# Altium project balancing.PrjPcb
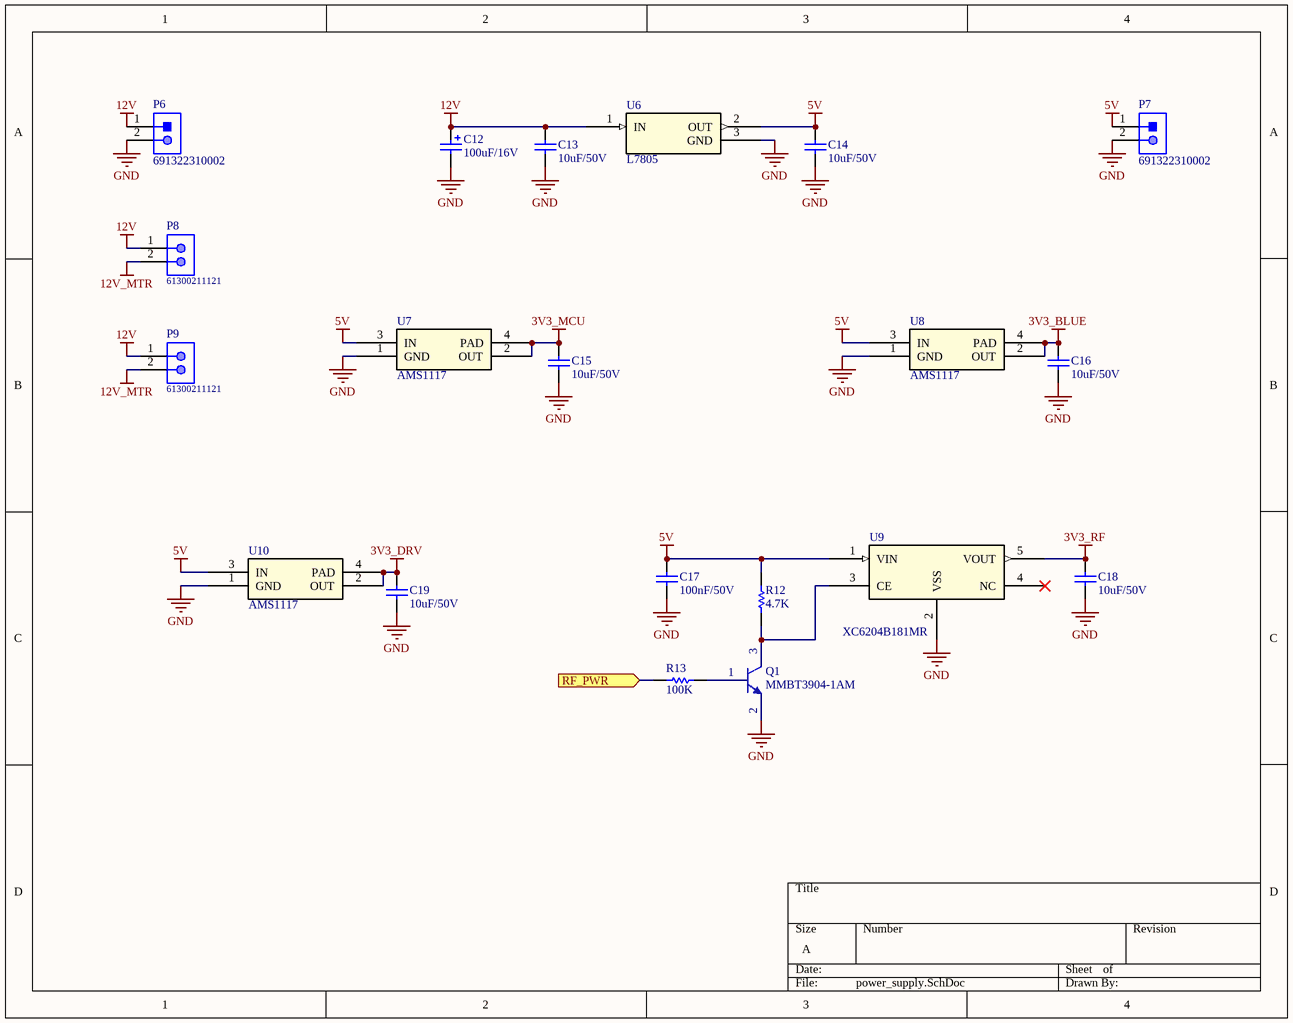
[diagram p0: power_supply.SchDoc]
4 sheets, 74 parts. Net scope: flat (ports and power ports of the same name join across sheets).
Board file: balancing.PcbDoc
Sheets:
  power_supply.SchDoc
  motor_controller.SchDoc
  mcu.SchDoc
  communication.SchDoc

## Sheet power_supply.SchDoc
size A

### Parts
C12  value 100uF/16V  [CAP-SM-AL-SIZE-D-D6L6]  (hidden comment: Cap-Al-100uF-16V-D6L5)
C13  value 10uF/50V  [CAP-SM-0805]  (hidden comment: Cap-10uF-50V-0805)
C14  value 10uF/50V  [CAP-SM-0805]  (hidden comment: Cap-10uF-50V-0805)
C15  value 10uF/50V  [CAP-SM-0805]  (hidden comment: Cap-10uF-50V-0805)
C16  value 10uF/50V  [CAP-SM-0805]  (hidden comment: Cap-10uF-50V-0805)
C17  value 100nF/50V  [CAP-SM-0805]  (hidden comment: Cap-100nF-50V-0805)
C18  value 10uF/50V  [CAP-SM-0805]  (hidden comment: Cap-10uF-50V-0805)
C19  value 10uF/50V  [CAP-SM-0805]  (hidden comment: Cap-10uF-50V-0805)
P6  691322310002  [691322310002]
P7  691322310002  [691322310002]
P8  61300211121  [61300211121]
P9  61300211121  [61300211121]
Q1  MMBT3904-1AM  [SOT23_NEX]
R12  value 4.7K  [RES-SM-0805]  (hidden comment: Res-4.7K-0805)
R13  value 100K  [RES-SM-0805]  (hidden comment: Res-100K-0805)
U6  L7805  [L7805]
U7  AMS1117  [AMS1117]
U8  AMS1117  [AMS1117]
U9  XC6204B181MR  [XC6204B181MR]
U10  AMS1117  [AMS1117]

### Ports
RF_PWR (in)

### Nets
3V3_BLUE: C16.2 U8.2(OUT) U8.4(PAD)
3V3_DRV: C19.2 U10.2(OUT) U10.4(PAD)
3V3_MCU: C15.2 U7.2(OUT) U7.4(PAD)
3V3_RF: C18.2 U9.5(VOUT)
5V: C14.2 C17.2 P7.1 R12.2 U6.2(OUT) U7.3(IN) U8.3(IN) U9.1(VIN) U10.3(IN)
12V: C12.1 C13.2 P6.1 P8.1 P9.1 U6.1(IN)
12V_MTR: P8.2 P9.2
GND: C12.2 C13.1 C14.1 C15.1 C16.1 C17.1 C18.1 C19.1 P6.2 P7.2 Q1.2(E) U6.3(GND) U7.1(GND) U8.1(GND) U9.2(VSS) U10.1(GND)
NetMCU1_15: R13.1 ; port RF_PWR
NetQ1_1: Q1.1(B) R13.2
NetQ1_3: Q1.3(C) R12.1 U9.3(CE)

Not connected (* = marked no-connect by the designer): U9 4(NC)*

### Library data of the parts
C12 = Cap-Al-100uF-16V-D6L5: CAP ALUM 100UF 20% 16V SMD; Manufacturer: Nichicon; Manufacturer Part Number: UWX1C101MCL1GB; Local Supplier: thegioiic; Local Supplier Link: https://thegioiic.com/products/tu-nhom-smd-100uf-16v-d6-3l5-4; Supplier 1: Digikey; Supplier 1 Part Number: 493-2105-1-ND; Supplier 1 Link: https://www.digikey.com/product-detail/en/nichicon/UWX1C101MCL1GB/493-2105-1-ND/590080
C13-C16 C18 C19 = Cap-10uF-50V-0805: CAP CER 10UF 50V X5R 0805; Manufacturer: Yageo; Manufacturer Part Number: CC0805KKX5R9BB106; Local Supplier: thegioiic; Local Supplier Link: https://thegioiic.com/products/tu-10uf-50v-0805; Supplier 1: Digikey; Supplier 1 Link: https://www.digikey.com/product-detail/en/yageo/CC0805KKX5R9BB106/311-3499-2-ND/7164383; Supplier 1 Part Number: 311-3499-2-ND
C17 = Cap-100nF-50V-0805: CAP CER 0.1UF 50V Y5V 0805; Manufacturer: Samsung Electro-Mechanics; Manufacturer Part Number: CL21F104ZBCNNNC; Local Supplier: thegioiic; Local Supplier Link: https://thegioiic.com/products/tu-100nf-0-1uf-50v-0805; Supplier 1: Digikey; Supplier 1 Part Number: 1276-1007-1-ND; Supplier 1 Link: https://www.digikey.com/product-detail/en/samsung-electro-mechanics/CL21F104ZBCNNNC/1276-1007-1-ND/3889093
P6 P7 = 691322310002: WR-TBL Serie 322 Horizontal PCB Header, Pluggable, pitch 3.81mm, 2p; Compliance: RoHS; Modularity: No; Pin Number: 2; Rated Current [UL]: 10A; Working Voltage [UL]: 300VAC; ComponentLink1Description: Manufacturer; ComponentLink1URL: http://www.we-online.de; ComponentLink2URL: https://katalog.we-online.de/em/datasheet/691322310002.pdf; ComponentLink2Description: Datasheet; Mounting Technology: THT; Part Number: 691322310002; Packaging: Box; Operating Temperature: -40 to +105degC; PCB/Cable/Panel: PCB; Pitch: 3.81mm; Published Date: October 2019; Type: Horizontal; Publisher: Wurth Elektronik; Application: Pluggable
P8 P9 = 61300211121: WR-PHD Pin Header, THT, pitch 2.54mm, Single Row, Vertical, 2p; Manufacturer: Wurth Elektronik; Pin Number: 2; Rated Current: 3A; Working Voltage: 250VAC; Withstanding Voltage: 500VAC; Contact Resistance: 20mOhm; ComponentLink1Description: Manufacturer; ComponentLink1URL: http://www.we-online.de; ComponentLink2Description: Datasheet; ComponentLink2URL: https://www.we-online.com/catalog/datasheet/61300211121.pdf; Manufacturer Part Number: 61300211121; Published Date: May 2020; Pitch: 2.54mm; Operating Temperature: -40 to +105degC; Mounting Technology: THT; Packaging: Bag; Gender: Pin Header; Row Number: Single; Orientation: Vertical
R12 = Res-4.7K-0805: RES SMD 4.7K OHM 5% 1/8W 0805; Manufacturer: Yageo; Manufacturer Part Number: RC0805JR-074K7L; Local Supplier: thegioiic; Local Supplier Link: https://thegioiic.com/products/dien-tro-4-7k-ohm-0805-5; Supplier 1: Digikey; Supplier 1 Link: https://www.digikey.com/product-detail/en/yageo/RC0805JR-074K7L/311-4.7KARCT-ND/731274; Supplier 1 Part Number: 311-4.7KARCT-ND
R13 = Res-100K-0805: RES 0 OHM JUMPER 0805; Manufacturer: Vishay Dale; Manufacturer Part Number: WSL080500000ZEA9; Local Supplier: thegioiic; Local Supplier Link: https://thegioiic.com/products/dien-tro-0-ohm-0805-5; Supplier 1: Digikey; Supplier 1 Link: https://www.digikey.com/product-detail/en/vishay-dale/WSL080500000ZEA9/541-3928-1-ND/7423223; Supplier 1 Part Number: 541-3928-1-ND
U6 = L7805: Manufacturer_Part_Number: L7805CDT-TR; Vendor: STMicroelectronics; Built_By: EMA_UL_Team; Copyright: Copyright (C) 2018 Accelerated Designs. All rights reserved; RefDes: RefDes; Type: DEV
U7 U8 U10 = AMS1117: Built_By: EMA_Matt; Vendor: AMS; SourceLibrary: AMS_2019-10-31; Manufacturer_Part_Number: AMS1117; Copyright: Copyright (C) 2018 Accelerated Designs. All rights reserved; RefDes: RefDes; Type: DEV
U9 = XC6204B181MR: Vendor: Torex Semiconductor; Built_By: EMA_UL_Team; SourceLibrary: Torex_2016-07-05_1; Manufacturer_Part_Number: XC6204B181MR; Copyright: Copyright (C) 2018 Accelerated Designs. All rights reserved; RefDes: RefDes; Type: DEV

## Sheet motor_controller.SchDoc
size A
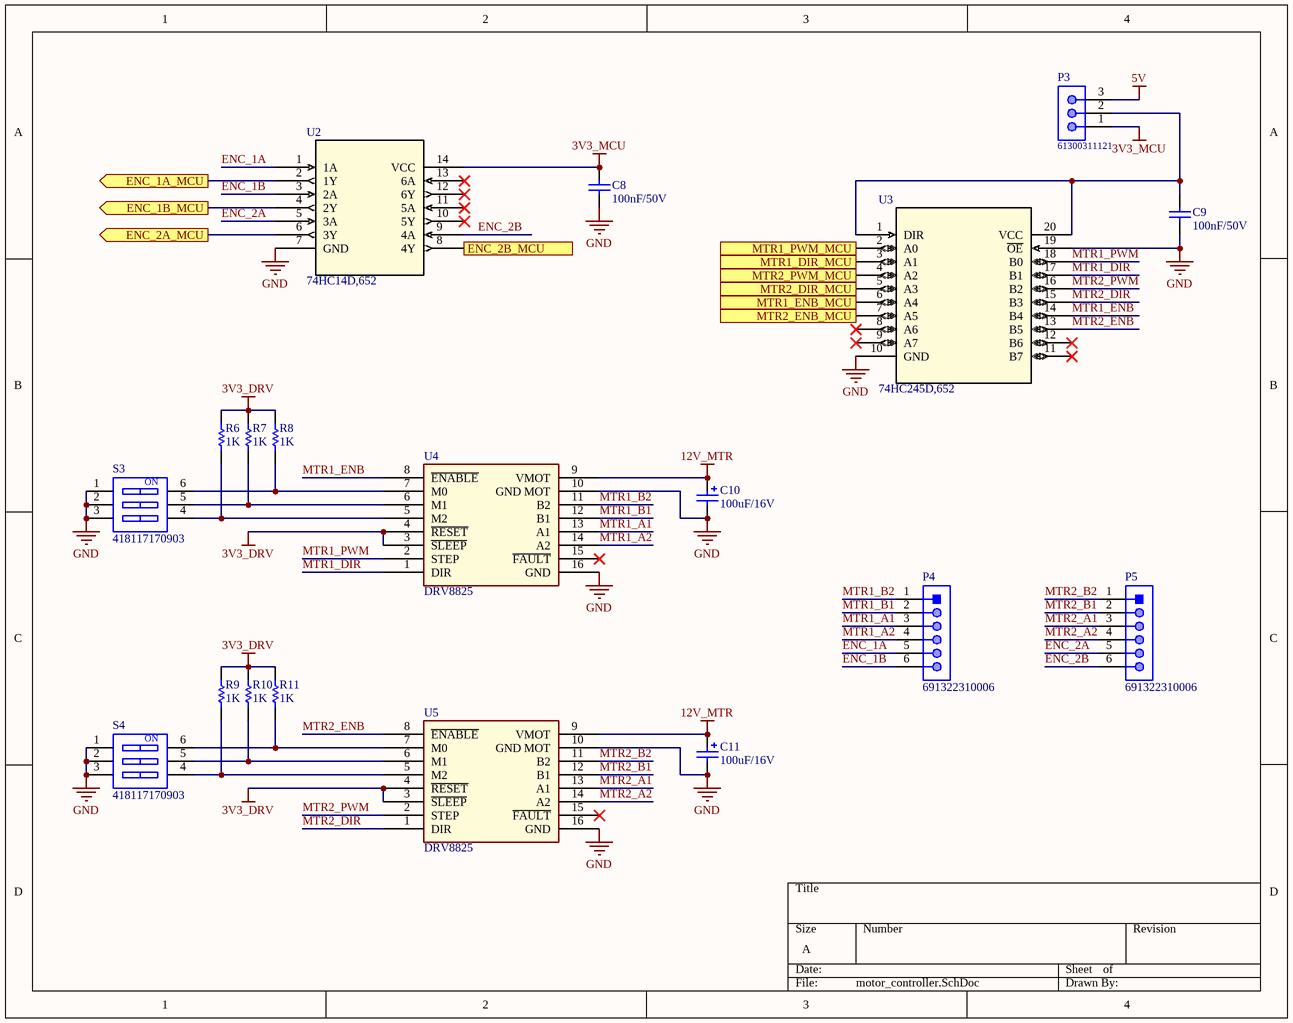
[diagram p1: motor_controller.SchDoc]

### Parts
C8  value 100nF/50V  [CAP-SM-0805]  (hidden comment: Cap-100nF-50V-0805)
C9  value 100nF/50V  [CAP-SM-0805]  (hidden comment: Cap-100nF-50V-0805)
C10  value 100uF/16V  [CAP-SM-AL-SIZE-D-D6L6]  (hidden comment: Cap-Al-100uF-16V-D6L5)
C11  value 100uF/16V  [CAP-SM-AL-SIZE-D-D6L6]  (hidden comment: Cap-Al-100uF-16V-D6L5)
P3  61300311121  [61300311121]
P4  691322310006  [691322310006]
P5  691322310006  [691322310006]
R6  value 1K  [RES-SM-0805]  (hidden comment: Res-1K-0805)
R7  value 1K  [RES-SM-0805]  (hidden comment: Res-1K-0805)
R8  value 1K  [RES-SM-0805]  (hidden comment: Res-1K-0805)
R9  value 1K  [RES-SM-0805]  (hidden comment: Res-1K-0805)
R10  value 1K  [RES-SM-0805]  (hidden comment: Res-1K-0805)
R11  value 1K  [RES-SM-0805]  (hidden comment: Res-1K-0805)
S3  418117170903  [418117170903]
S4  418117170903  [418117170903]
U2  74HC14D,652  [74HC14D,652]
U3  74HC245D,652  [74HC245D,652]
U4  DRV8825  [DRV8825]
U5  DRV8825  [DRV8825]

### Ports
ENC_1A_MCU (out), ENC_1B_MCU (out), ENC_2A_MCU (out), ENC_2B_MCU (out), MTR1_DIR_MCU (in), MTR1_ENB_MCU (in), MTR1_PWM_MCU (in), MTR2_DIR_MCU (in), MTR2_ENB_MCU (in), MTR2_PWM_MCU (in)

### Nets
3V3_DRV: R6.2 R7.2 R8.2 R9.2 R10.2 R11.2 U4.3(~{SLEEP}) U4.4(~{RESET}) U5.3(~{SLEEP}) U5.4(~{RESET})
3V3_MCU: C8.2 P3.1 U2.14(VCC)
5V: P3.3
12V_MTR: C10.1 C11.1 U4.9(VMOT) U5.9(VMOT)
GND: C8.1 C9.1 C10.2 C11.2 S3.1 S3.2 S3.3 S4.1 S4.2 S4.3 U2.7(GND) U3.10(GND) U3.19(~{OE}) U4.10(GND_MOT) U4.16(GND) U5.10(GND_MOT) U5.16(GND)
ENC_1A: P4.5 U2.1(1A)
ENC_1B: P4.6 U2.3(2A)
ENC_2A: P5.5 U2.5(3A)
ENC_2B: P5.6 U2.9(4A)
MTR1_A1: P4.3 U4.13(A1)
MTR1_A2: P4.4 U4.14(A2)
MTR1_B1: P4.2 U4.12(B1)
MTR1_B2: P4.1 U4.11(B2)
MTR1_DIR: U3.17(B1) U4.1(DIR)
MTR1_ENB: U3.14(B4) U4.8(~{ENABLE})
MTR1_PWM: U3.18(B0) U4.2(STEP)
MTR2_A1: P5.3 U5.13(A1)
MTR2_A2: P5.4 U5.14(A2)
MTR2_B1: P5.2 U5.12(B1)
MTR2_B2: P5.1 U5.11(B2)
MTR2_DIR: U3.15(B3) U5.1(DIR)
MTR2_ENB: U3.13(B5) U5.8(~{ENABLE})
MTR2_PWM: U3.16(B2) U5.2(STEP)
NetC9_2: C9.2 P3.2 U3.1(DIR) U3.20(VCC)
NetMCU1_3: U3.3(A1) ; port MTR1_DIR_MCU
NetMCU1_4: U3.6(A4) ; port MTR1_ENB_MCU
NetMCU1_5: U3.5(A3) ; port MTR2_DIR_MCU
NetMCU1_6: U3.7(A5) ; port MTR2_ENB_MCU
NetMCU1_10: U3.2(A0) ; port MTR1_PWM_MCU
NetMCU1_11: U3.4(A2) ; port MTR2_PWM_MCU
NetMCU1_16: U2.2(1Y) ; port ENC_1A_MCU
NetMCU1_17: U2.4(2Y) ; port ENC_1B_MCU
NetMCU1_42: U2.8(4Y) ; port ENC_2B_MCU
NetMCU1_43: U2.6(3Y) ; port ENC_2A_MCU
NetR6_1: R6.1 S3.4 U4.5(M2)
NetR7_1: R7.1 S3.5 U4.6(M1)
NetR8_1: R8.1 S3.6 U4.7(M0)
NetR9_1: R9.1 S4.4 U5.5(M2)
NetR10_1: R10.1 S4.5 U5.6(M1)
NetR11_1: R11.1 S4.6 U5.7(M0)

Not connected (* = marked no-connect by the designer): U2 10(5Y)* 11(5A)* 12(6Y)* 13(6A)*; U3 8(A6)* 9(A7)* 11(B7)* 12(B6)*; U4 15(~{FAULT})*; U5 15(~{FAULT})*

### Notes on the sheet
- (in symbol 418117170903) ON

### Library data of the parts
C8 C9 = Cap-100nF-50V-0805: as C17 on sheet power_supply; Local Supplier: thegioiic; Local Supplier Link: https://thegioiic.com/products/tu-100nf-0-1uf-50v-0805; Supplier 1: Digikey; Supplier 1 Part Number: 1276-1007-1-ND; Supplier 1 Link: https://www.digikey.com/product-detail/en/samsung-electro-mechanics/CL21F104ZBCNNNC/1276-1007-1-ND/3889093
C10 C11 = Cap-Al-100uF-16V-D6L5: as C12 on sheet power_supply; Local Supplier: thegioiic; Local Supplier Link: https://thegioiic.com/products/tu-nhom-smd-100uf-16v-d6-3l5-4; Supplier 1: Digikey; Supplier 1 Part Number: 493-2105-1-ND; Supplier 1 Link: https://www.digikey.com/product-detail/en/nichicon/UWX1C101MCL1GB/493-2105-1-ND/590080
P3 = 61300311121: WR-PHD Pin Header, THT, pitch 2.54mm, Single Row, Vertical, 3p; Manufacturer: Wurth Elektronik; Pin Number: 3; Rated Current: 3A; Working Voltage: 250VAC; Withstanding Voltage: 500VAC; Contact Resistance: 20mOhm; ComponentLink1Description: Manufacturer; ComponentLink1URL: http://www.we-online.de; ComponentLink2Description: Datasheet; ComponentLink2URL: https://www.we-online.com/catalog/datasheet/61300311121.pdf; Manufacturer Part Number: 61300311121; Published Date: May 2020; Pitch: 2.54mm; Operating Temperature: -40 to +105degC; Mounting Technology: THT; Packaging: Bag; Gender: Pin Header; Row Number: Single; Orientation: Vertical
P4 P5 = 691322310006: WR-TBL Serie 322 Horizontal PCB Header, Pluggable, pitch 3.81mm, 6p; Compliance: RoHS; Modularity: No; Pin Number: 6; Rated Current [UL]: 10A; Working Voltage [UL]: 300VAC; ComponentLink1Description: Manufacturer; ComponentLink1URL: http://www.we-online.de; ComponentLink2URL: https://katalog.we-online.de/em/datasheet/691322310006.pdf; ComponentLink2Description: Datasheet; Mounting Technology: THT; Part Number: 691322310006; Packaging: Box; Operating Temperature: -40 to +105degC; PCB/Cable/Panel: PCB; Pitch: 3.81mm; Published Date: October 2019; Type: Horizontal; Publisher: Wurth Elektronik; Application: Pluggable
R6-R11 = Res-1K-0805: RES 1K OHM 1% 1/4W 0805; Manufacturer: Stackpole Electronics Inc; Manufacturer Part Number: RNCP0805FTD1K00; Local Supplier: thegioiic; Local Supplier Link: https://thegioiic.com/products/dien-tro-1k-ohm-0805-5; Supplier 1: Digikey; Supplier 1 Link: https://www.digikey.com/product-detail/en/stackpole-electronics-inc/RNCP0805FTD1K00/RNCP0805FTD1K00CT-ND/2240568; Supplier 1 Part Number: RNCP0805FTD1K00CT-ND
S3 S4 = 418117170903: WS-DITV Compact THT Dip Switch, Flat Actuator, pitch 2.54mm, 3p; Operation Force: 800g; Pole Number: 3; Actuator Type: Flat Type; Circuit: SPST-NO; Rated Current Switching: 25mA; Rated Current Non-Switching: 100mA; Rated Voltage Non-Switching: 50VDC; Rated Voltage Switching: 24VDC; ComponentLink1Description: Manufacturer; ComponentLink1URL: http://www.we-online.de; ComponentLink2Description: Datasheet; ComponentLink2URL: https://katalog.we-online.com/em/datasheet/418117170903.pdf; Pitch: 2.54mm; Contact Material: Copper Alloy; Mounting Technology: THT; Operating Temperature: -40 to +85degC; Contact Plating: Gold; Packaging: Tube; Part Number: 418117170903; Publisher: Wurth Elektronik; Published Date: September 2019
U2 = 74HC14D,652: Vendor: Nexperia; SourceLibrary: Nexperia_2018-05-2018; Manufacturer_Part_Number: 74HC14D,652; Copyright: Copyright (C) 2016 Accelerated Designs. All rights reserved; RefDes: RefDes; Type: DEV
U3 = 74HC245D,652: Vendor: Nexperia; SourceLibrary: Nexperia_2018-05-2018; Manufacturer_Part_Number: 74HC245D,652; Copyright: Copyright (C) 2016 Accelerated Designs. All rights reserved; RefDes: RefDes; Type: DEV

## Sheet mcu.SchDoc
size A
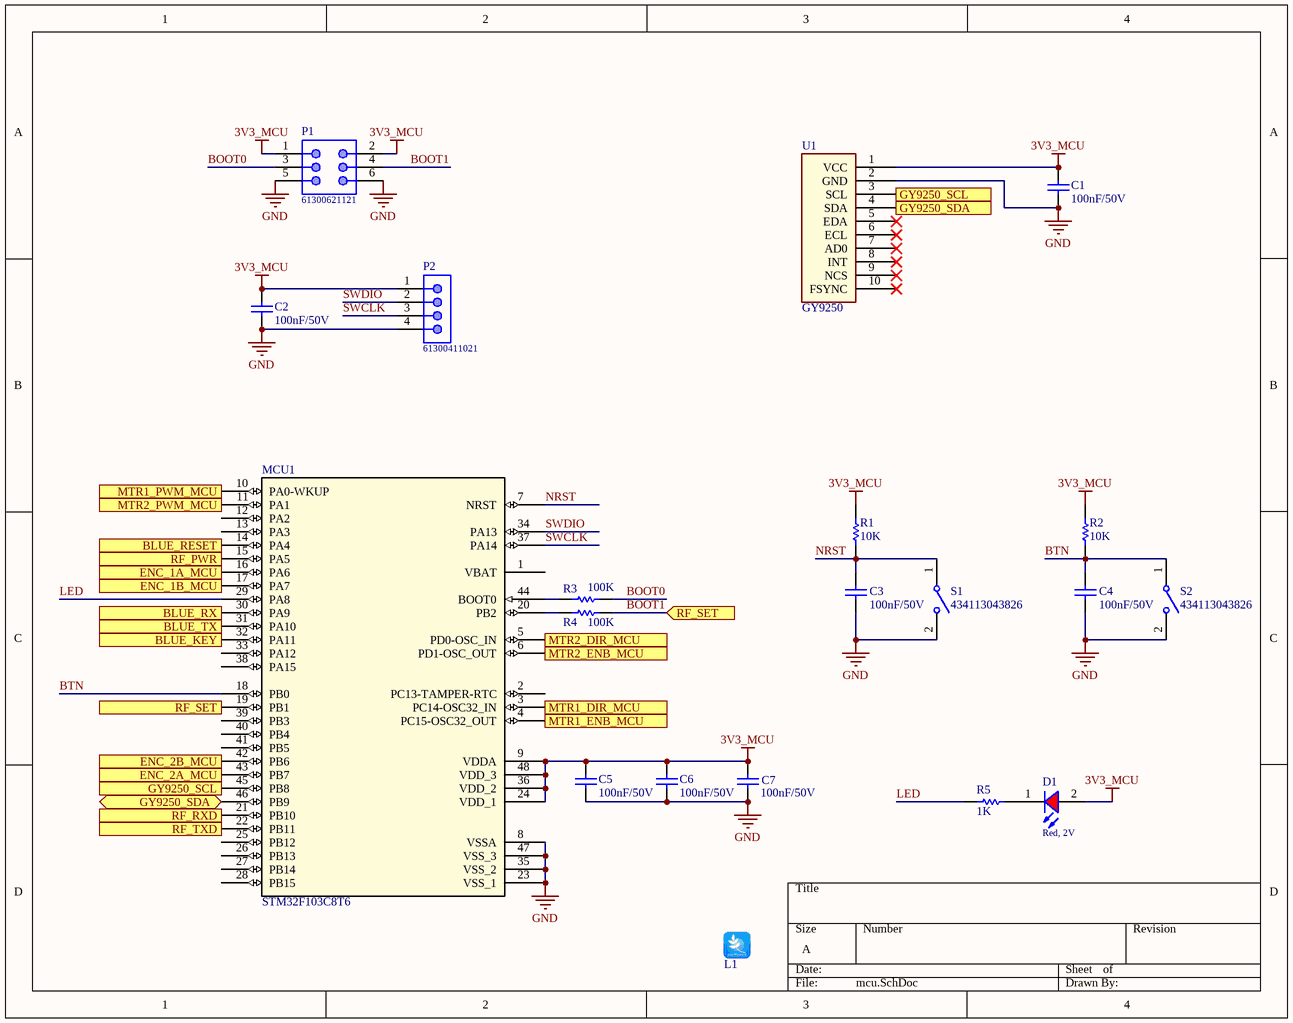
[diagram p2: mcu.SchDoc]

### Parts
C1  value 100nF/50V  [CAP-SM-0805]  (hidden comment: Cap-100nF-50V-0805)
C2  value 100nF/50V  [CAP-SM-0805]  (hidden comment: Cap-100nF-50V-0805)
C3  value 100nF/50V  [CAP-SM-0805]  (hidden comment: Cap-100nF-50V-0805)
C4  value 100nF/50V  [CAP-SM-0805]  (hidden comment: Cap-100nF-50V-0805)
C5  value 100nF/50V  [CAP-SM-0805]  (hidden comment: Cap-100nF-50V-0805)
C6  value 100nF/50V  [CAP-SM-0805]  (hidden comment: Cap-100nF-50V-0805)
C7  value 100nF/50V  [CAP-SM-0805]  (hidden comment: Cap-100nF-50V-0805)
D1  Red, 2V  [WL-SMCW_0805]
L1  LogoPIF  [PIF LOGO TOP OVERLAY]  (value not drawn)
MCU1  STM32F103C8T6  [STM32F103C8T6]
P1  61300621121  [61300621121]
P2  61300411021  [61300411021]
R1  value 10K  [RES-SM-0805]  (hidden comment: Res-10k-0805)
R2  value 10K  [RES-SM-0805]  (hidden comment: Res-10k-0805)
R3  value 100K  [RES-SM-0805]  (hidden comment: Res-100K-0805)
R4  value 100K  [RES-SM-0805]  (hidden comment: Res-100K-0805)
R5  value 1K  [RES-SM-0805]  (hidden comment: Res-1K-0805)
S1  434113043826  [434113043826]
S2  434113043826  [434113043826]
U1  GY9250  [GY9250]

### Ports
BLUE_KEY (out), BLUE_RESET (out), BLUE_RX (out), BLUE_TX (in), ENC_1A_MCU (in), ENC_1B_MCU (in), ENC_2A_MCU (in), ENC_2B_MCU (in), GY9250_SCL (in), GY9250_SCL (out), GY9250_SDA (bidir), GY9250_SDA (out), MTR1_DIR_MCU (out), MTR1_ENB_MCU (out), MTR1_PWM_MCU (out), MTR2_DIR_MCU (out), MTR2_ENB_MCU (out), MTR2_PWM_MCU (out), RF_PWR (out), RF_RXD (out), RF_SET (in), RF_SET (out), RF_TXD (in)

### Nets
3V3_MCU: C1.2 C2.2 C5.1 C6.1 C7.2 D1.2(A) MCU1.9(VDDA) MCU1.24(VDD_1) MCU1.36(VDD_2) MCU1.48(VDD_3) P1.1 P1.2 P2.1 R1.2 R2.2 U1.1(VCC)
GND: C1.1 C2.1 C3.1 C4.1 C5.2 C6.2 C7.1 MCU1.8(VSSA) MCU1.23(VSS_1) MCU1.35(VSS_2) MCU1.47(VSS_3) P1.5 P1.6 P2.4 S1.2 S2.2 U1.2(GND)
BLUE_KEY: MCU1.32(PA11) ; port BLUE_KEY
BLUE_RX: MCU1.30(PA9) ; port BLUE_RX
BLUE_TX: MCU1.31(PA10) ; port BLUE_TX
BOOT0: P1.3 R3.2
BOOT1: MCU1.19(PB1) P1.4 R4.2 ; port RF_SET
BTN: C4.2 MCU1.18(PB0) R2.1 S2.1
LED: MCU1.29(PA8) R5.1
NRST: C3.2 MCU1.7(NRST) R1.1 S1.1
RF_RXD: MCU1.21(PB10) ; port RF_RXD
RF_TXD: MCU1.22(PB11) ; port RF_TXD
SWCLK: MCU1.37(PA14) P2.3
SWDIO: MCU1.34(PA13) P2.2
NetD1_1: D1.1(K) R5.2
NetMCU1_3: MCU1.3(PC14-OSC32_IN) ; port MTR1_DIR_MCU
NetMCU1_4: MCU1.4(PC15-OSC32_OUT) ; port MTR1_ENB_MCU
NetMCU1_5: MCU1.5(PD0-OSC_IN) ; port MTR2_DIR_MCU
NetMCU1_6: MCU1.6(PD1-OSC_OUT) ; port MTR2_ENB_MCU
NetMCU1_10: MCU1.10(PA0-WKUP) ; port MTR1_PWM_MCU
NetMCU1_11: MCU1.11(PA1) ; port MTR2_PWM_MCU
NetMCU1_14: MCU1.14(PA4) ; port BLUE_RESET
NetMCU1_15: MCU1.15(PA5) ; port RF_PWR
NetMCU1_16: MCU1.16(PA6) ; port ENC_1A_MCU
NetMCU1_17: MCU1.17(PA7) ; port ENC_1B_MCU
NetMCU1_20: MCU1.20(PB2) R4.1
NetMCU1_42: MCU1.42(PB6) ; port ENC_2B_MCU
NetMCU1_43: MCU1.43(PB7) ; port ENC_2A_MCU
NetMCU1_44: MCU1.44(BOOT0) R3.1
NetMCU1_45: MCU1.45(PB8) U1.3(SCL) ; port GY9250_SCL
NetMCU1_46: MCU1.46(PB9) U1.4(SDA) ; port GY9250_SDA

Not connected (* = marked no-connect by the designer): MCU1 1(VBAT) 2(PC13-TAMPER-RTC) 12(PA2) 13(PA3) 25(PB12) 26(PB13) 27(PB14) 28(PB15) 33(PA12) 38(PA15) 39(PB3) 40(PB4) 41(PB5); U1 5(EDA)* 6(ECL)* 7(AD0)* 8(INT)* 9(NCS)* 10(FSYNC)*

### Library data of the parts
C1-C7 = Cap-100nF-50V-0805: as C17 on sheet power_supply; Local Supplier: thegioiic; Local Supplier Link: https://thegioiic.com/products/tu-100nf-0-1uf-50v-0805; Supplier 1: Digikey; Supplier 1 Part Number: 1276-1007-1-ND; Supplier 1 Link: https://www.digikey.com/product-detail/en/samsung-electro-mechanics/CL21F104ZBCNNNC/1276-1007-1-ND/3889093
D1 = 150080RS75000: WL-SMCW SMT Mono-color Chip LED Waterclear, size 0805, Red, 2V, 140deg; Chip Technology: AlInGaP; Dominant Wavelength typ.: 625nm; Luminous Intensity typ.: 150mcd; Peak Wavelength typ.: 630nm; Viewing Angle: 140deg; ComponentLink1Description: Manufacturer; ComponentLink1URL: http://www.we-online.de; ComponentLink2URL: https://www.we-online.com/catalog/datasheet/150080RS75000.pdf; ComponentLink2Description: Datasheet; Forward Voltage typ.: 2V; Emitting Color: Red; Mounting Technology: SMT; Operating Temperature: -40 to +85degC; Published Date: December 2019; Part Number: 150080RS75000; Packaging: Tape and Reel; Size: 0805; Publisher: Wurth Elektronik
MCU1 = STM32F103C8T6: Vendor: STMicroelectronics; Built_By: EMA_UL_Team; Manufacturer_Part_Number: STM32F103C8T6; Copyright: Copyright (C) 2018 Accelerated Designs. All rights reserved; RefDes: RefDes; Type: DEV
P1 = 61300621121: WR-PHD Pin Header, THT, pitch 2.54mm, Dual Row, Vertical, 6p; Manufacturer: Wurth Elektronik; Pin Number: 6; Rated Current: 3A; Working Voltage: 250VAC; Withstanding Voltage: 500VAC; Contact Resistance: 20mOhm; ComponentLink1Description: Manufacturer; ComponentLink1URL: http://www.we-online.de; ComponentLink2Description: Datasheet; ComponentLink2URL: https://www.we-online.com/catalog/datasheet/61300621121.pdf; Manufacturer Part Number: 61300621121; Published Date: May 2020; Pitch: 2.54mm; Operating Temperature: -40 to +105degC; Mounting Technology: THT; Packaging: Bag; Gender: Pin Header; Row Number: Dual; Orientation: Vertical
P2 = 61300411021: WR-PHD Pin Header, THT, pitch 2.54mm, Single Row, Angled, 4p; Manufacturer: Wurth Elektronik; Pin Number: 4; Rated Current: 3A; Working Voltage: 250VAC; Withstanding Voltage: 500VAC; Contact Resistance: 20mOhm; ComponentLink1Description: Manufacturer; ComponentLink1URL: http://www.we-online.de; ComponentLink2Description: Datasheet; ComponentLink2URL: https://www.we-online.com/catalog/datasheet/61300411021.pdf; Manufacturer Part Number: 61300411021; Published Date: May 2020; Pitch: 2.54mm; Operating Temperature: -40 to +105degC; Mounting Technology: THT; Packaging: Bag; Gender: Pin Header; Row Number: Single; Orientation: Angled
R1 R2 = Res-10k-0805: RES 10K OHM 1% 1/4W 0805; Manufacturer: Stackpole Electronics Inc; Manufacturer Part Number: RNCP0805FTD10K0; Local Supplier: thegioiic; Local Supplier Link: https://thegioiic.com/products/dien-tro-10k-ohm-0805-5; Supplier 1: Digikey; Supplier 1 Link: https://www.digikey.com/product-detail/en/stackpole-electronics-inc/RNCP0805FTD10K0/RNCP0805FTD10K0CT-ND/2240601; Supplier 1 Part Number: RNCP0805FTD10K0CT-ND
R3 R4 = Res-100K-0805: as R13 on sheet power_supply; Local Supplier: thegioiic; Local Supplier Link: https://thegioiic.com/products/dien-tro-0-ohm-0805-5; Supplier 1: Digikey; Supplier 1 Link: https://www.digikey.com/product-detail/en/vishay-dale/WSL080500000ZEA9/541-3928-1-ND/7423223; Supplier 1 Part Number: 541-3928-1-ND
R5 = Res-1K-0805: as R6 on sheet motor_controller; Local Supplier: thegioiic; Local Supplier Link: https://thegioiic.com/products/dien-tro-1k-ohm-0805-5; Supplier 1: Digikey; Supplier 1 Link: https://www.digikey.com/product-detail/en/stackpole-electronics-inc/RNCP0805FTD1K00/RNCP0805FTD1K00CT-ND/2240568; Supplier 1 Part Number: RNCP0805FTD1K00CT-ND
S1 S2 = 434113043826: WS-TASV J-Bend SMT Tact Switch 6x3.5mm, height 4.3mm, 260gf; Rated Voltage: 12VDC; Rated Current: 50mA; Washable: No; ComponentLink1Description: Manufacturer; ComponentLink1URL: http://www.we-online.de; ComponentLink2Description: Datasheet; ComponentLink2URL: https://katalog.we-online.com/em/datasheet/434113043826.pdf; Operating Temperature: -40 to +85degC; Part Number: 434113043826; Published Date: September 2019; Contact Material: Stainless Steel; Height: 4.3mm; Mounting Technology: SMT; Contact Plating: Silver; Operation Force: 260gf; Packaging: Tape and Reel; Terminal Material: Copper Alloy; Publisher: Wurth Elektronik; Terminal Plating: Silver
L1 = LogoPIF: Local Supplier: x; Local Supplier Link: x
U1 = GY9250: Local Supplier Part Number: *; Local Supplier Link: *; Local Supplier: HShop; Manufacturer: *; Manufacturer Part Number: *

## Sheet communication.SchDoc
size A
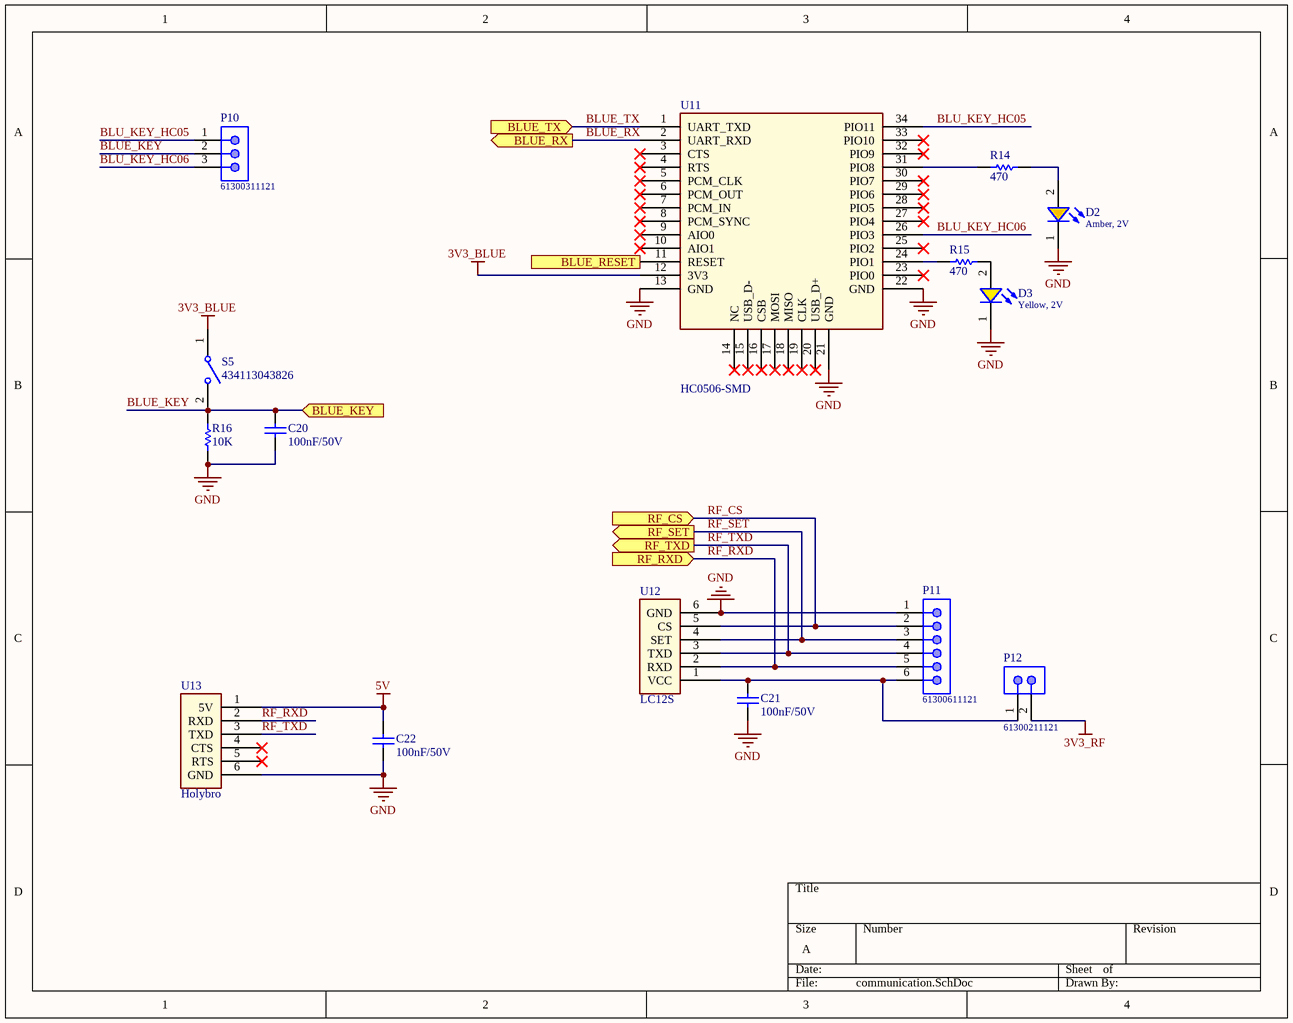
[diagram p3: communication.SchDoc]

### Parts
C20  value 100nF/50V  [CAP-SM-0805]  (hidden comment: Cap-100nF-50V-0805)
C21  value 100nF/50V  [CAP-SM-0805]  (hidden comment: Cap-100nF-50V-0805)
C22  value 100nF/50V  [CAP-SM-0805]  (hidden comment: Cap-100nF-50V-0805)
D2  Amber, 2V  [WL-SMCW_0805]
D3  Yellow, 2V  [WL-SMCW_0805]
P10  61300311121  [61300311121]
P11  61300611121  [61300611121]
P12  61300211121  [61300211121]
R14  value 470  [RES-SM-0805]  (hidden comment: Res-470-0805)
R15  value 470  [RES-SM-0805]  (hidden comment: Res-470-0805)
R16  value 10K  [RES-SM-0805]  (hidden comment: Res-10k-0805)
S5  434113043826  [434113043826]
U11  HC0506-SMD  [HC0506-SMD]
U12  LC12S  [LC12S]
U13  Holybro  [Holybro]

### Ports
BLUE_KEY (in), BLUE_RESET (in), BLUE_RX (out), BLUE_TX (in), RF_CS (in), RF_RXD (in), RF_SET (out), RF_TXD (out)

### Nets
3V3_BLUE: S5.1 U11.12(3V3)
3V3_RF: P12.2
5V: C22.2 U13.1(5V)
GND: C20.1 C21.1 C22.1 D2.1(K) D3.1(K) P11.1 R16.2 U11.13(GND) U11.21(GND) U11.22(GND) U12.6(GND) U13.6(GND)
BLU_KEY_HC05: P10.1 U11.34(PIO11)
BLU_KEY_HC06: P10.3 U11.26(PIO3)
BLUE_KEY: C20.2 P10.2 R16.1 S5.2 ; port BLUE_KEY
BLUE_RX: U11.2(UART_RXD) ; port BLUE_RX
BLUE_TX: U11.1(UART_TXD) ; port BLUE_TX
RF_CS: P11.2 U12.5(CS) ; port RF_CS
RF_RXD: P11.5 U12.2(RXD) U13.2(RXD) ; port RF_RXD
RF_SET: P11.3 U12.4(SET) ; port RF_SET  [project net BOOT1]
RF_TXD: P11.4 U12.3(TXD) U13.3(TXD) ; port RF_TXD
NetC21_2: C21.2 P11.6 P12.1 U12.1(VCC)
NetD2_2: D2.2(A) R14.2
NetD3_2: D3.2(A) R15.2
NetMCU1_14: U11.11(RESET) ; port BLUE_RESET
NetR14_1: R14.1 U11.31(PIO8)
NetR15_1: R15.1 U11.24(PIO1)

Not connected (* = marked no-connect by the designer): U11 3(CTS)* 4(RTS)* 5(PCM_CLK)* 6(PCM_OUT)* 7(PCM_IN)* 8(PCM_SYNC)* 9(AIO0)* 10(AIO1)* 14(NC)* 15(USB_D-)* 16(CSB)* 17(MOSI)* 18(MISO)* 19(CLK)* 20(USB_D+)* 23(PIO0)* 25(PIO2)* 27(PIO4)* 28(PIO5)* 29(PIO6)* 30(PIO7)* 32(PIO9)* 33(PIO10)*; U13 4(CTS)* 5(RTS)*

### Library data of the parts
C20-C22 = Cap-100nF-50V-0805: as C17 on sheet power_supply; Local Supplier: thegioiic; Local Supplier Link: https://thegioiic.com/products/tu-100nf-0-1uf-50v-0805; Supplier 1: Digikey; Supplier 1 Part Number: 1276-1007-1-ND; Supplier 1 Link: https://www.digikey.com/product-detail/en/samsung-electro-mechanics/CL21F104ZBCNNNC/1276-1007-1-ND/3889093
D2 = 150080AS75000: WL-SMCW SMT Mono-color Chip LED Waterclear, size 0805, Amber, 2V, 140deg; Chip Technology: AlInGaP; Dominant Wavelength typ.: 605nm; Luminous Intensity typ.: 130mcd; Peak Wavelength typ.: 610nm; Viewing Angle: 140deg; ComponentLink1Description: Manufacturer; ComponentLink1URL: http://www.we-online.de; ComponentLink2URL: https://www.we-online.com/catalog/datasheet/150080AS75000.pdf; ComponentLink2Description: Datasheet; Forward Voltage typ.: 2V; Emitting Color: Amber; Mounting Technology: SMT; Operating Temperature: -40 to +85degC; Published Date: December 2019; Part Number: 150080AS75000; Packaging: Tape and Reel; Size: 0805; Publisher: Wurth Elektronik
D3 = 150080YS75000: WL-SMCW SMT Mono-color Chip LED Waterclear, size 0805, Yellow, 2V, 140deg; Chip Technology: AlInGaP; Dominant Wavelength typ.: 590nm; Luminous Intensity typ.: 120mcd; Peak Wavelength typ.: 595nm; Viewing Angle: 140deg; ComponentLink1Description: Manufacturer; ComponentLink1URL: http://www.we-online.de; ComponentLink2URL: https://www.we-online.com/catalog/datasheet/150080YS75000.pdf; ComponentLink2Description: Datasheet; Forward Voltage typ.: 2V; Emitting Color: Yellow; Mounting Technology: SMT; Operating Temperature: -40 to +85degC; Published Date: December 2019; Part Number: 150080YS75000; Packaging: Tape and Reel; Size: 0805; Publisher: Wurth Elektronik
P10 = 61300311121: as P3 on sheet motor_controller; ComponentLink1Description: Manufacturer; ComponentLink1URL: http://www.we-online.de; ComponentLink2Description: Datasheet; ComponentLink2URL: https://www.we-online.com/catalog/datasheet/61300311121.pdf; Manufacturer Part Number: 61300311121; Published Date: May 2020; Pitch: 2.54mm; Operating Temperature: -40 to +105degC; Mounting Technology: THT; Packaging: Bag; Gender: Pin Header; Row Number: Single; Orientation: Vertical
P11 = 61300611121: WR-PHD Pin Header, THT, pitch 2.54mm, Single Row, Vertical, 6p; Manufacturer: Wurth Elektronik; Pin Number: 6; Rated Current: 3A; Working Voltage: 250VAC; Withstanding Voltage: 500VAC; Contact Resistance: 20mOhm; ComponentLink1Description: Manufacturer; ComponentLink1URL: http://www.we-online.de; ComponentLink2Description: Datasheet; ComponentLink2URL: https://www.we-online.com/catalog/datasheet/61300611121.pdf; Manufacturer Part Number: 61300611121; Published Date: May 2020; Pitch: 2.54mm; Operating Temperature: -40 to +105degC; Mounting Technology: THT; Packaging: Bag; Gender: Pin Header; Row Number: Single; Orientation: Vertical
P12 = 61300211121: as P8 on sheet power_supply; ComponentLink1Description: Manufacturer; ComponentLink1URL: http://www.we-online.de; ComponentLink2Description: Datasheet; ComponentLink2URL: https://www.we-online.com/catalog/datasheet/61300211121.pdf; Manufacturer Part Number: 61300211121; Published Date: May 2020; Pitch: 2.54mm; Operating Temperature: -40 to +105degC; Mounting Technology: THT; Packaging: Bag; Gender: Pin Header; Row Number: Single; Orientation: Vertical
R14 R15 = Res-470-0805: RES 470 OHM JUMPER 0805; Manufacturer: YAG6006CT-ND; Manufacturer Part Number: PE0805FRF7W0R047L; Local Supplier: thegioiic; Local Supplier Link: https://www.thegioiic.com/products/dien-tro-470-kohm-0805-5; Supplier 1: Digikey; Supplier 1 Link: https://www.digikey.com/product-detail/en/yageo/PE0805FRF7W0R047L/YAG6006CT-ND/9696460; Supplier 1 Part Number: YAG6006CT-ND
R16 = Res-10k-0805: as R1 on sheet mcu; Local Supplier: thegioiic; Local Supplier Link: https://thegioiic.com/products/dien-tro-10k-ohm-0805-5; Supplier 1: Digikey; Supplier 1 Link: https://www.digikey.com/product-detail/en/stackpole-electronics-inc/RNCP0805FTD10K0/RNCP0805FTD10K0CT-ND/2240601; Supplier 1 Part Number: RNCP0805FTD10K0CT-ND
S5 = 434113043826: as S1 on sheet mcu; ComponentLink1Description: Manufacturer; ComponentLink1URL: http://www.we-online.de; ComponentLink2Description: Datasheet; ComponentLink2URL: https://katalog.we-online.com/em/datasheet/434113043826.pdf; Operating Temperature: -40 to +85degC; Part Number: 434113043826; Published Date: September 2019; Contact Material: Stainless Steel; Height: 4.3mm; Mounting Technology: SMT; Contact Plating: Silver; Operation Force: 260gf; Packaging: Tape and Reel; Terminal Material: Copper Alloy; Publisher: Wurth Elektronik; Terminal Plating: Silver
U11 = HC0506-SMD: Local Supplier: HShop; Local Supplier Part Name: HS000881; Local Supplier Link: https://hshop.vn/products/mach-thu-phat-bluetooth-hc-05-chua-ra-chon-master; Manufacturer: *; Manufacturer Part Name: *
U12 = LC12S: Local Supplier: HShop; Local Supplier Link: https://hshop.vn/products/mach-thu-phat-rf-uart-lc12s-2-4ghz; Local Supplier Part Number: HS000895; Manufacturer: *; Manufacturer Part Number: *
U13 = Holybro: Local Supplier: *; Local Supplier Link: *; Local Supplier Part Number: *; Manufacturer: *; Manufacturer Part Number: *

## Nets that join several sheets
3V3_BLUE: power_supply (C16.2 U8.2 U8.4), communication (S5.1 U11.12)
3V3_DRV: power_supply (C19.2 U10.2 U10.4), motor_controller (10 pins)
3V3_MCU: power_supply (C15.2 U7.2 U7.4), motor_controller (C8.2 P3.1 U2.14), mcu (16 pins)
3V3_RF: power_supply (C18.2 U9.5), communication (P12.2)
5V: power_supply (9 pins), motor_controller (P3.3), communication (C22.2 U13.1)
12V_MTR: power_supply (P8.2 P9.2), motor_controller (C10.1 C11.1 U4.9 U5.9)
GND: power_supply (16 pins), motor_controller (17 pins), mcu (17 pins), communication (12 pins)
BLUE_KEY: mcu (MCU1.32), communication (C20.2 P10.2 R16.1 S5.2)
BLUE_RX: mcu (MCU1.30), communication (U11.2)
BLUE_TX: mcu (MCU1.31), communication (U11.1)
BOOT1: mcu (MCU1.19 P1.4 R4.2), communication (P11.3 U12.4)
NetMCU1_3: motor_controller (U3.3), mcu (MCU1.3)
NetMCU1_4: motor_controller (U3.6), mcu (MCU1.4)
NetMCU1_5: motor_controller (U3.5), mcu (MCU1.5)
NetMCU1_6: motor_controller (U3.7), mcu (MCU1.6)
NetMCU1_10: motor_controller (U3.2), mcu (MCU1.10)
NetMCU1_11: motor_controller (U3.4), mcu (MCU1.11)
NetMCU1_14: mcu (MCU1.14), communication (U11.11)
NetMCU1_15: power_supply (R13.1), mcu (MCU1.15)
NetMCU1_16: motor_controller (U2.2), mcu (MCU1.16)
NetMCU1_17: motor_controller (U2.4), mcu (MCU1.17)
NetMCU1_42: motor_controller (U2.8), mcu (MCU1.42)
NetMCU1_43: motor_controller (U2.6), mcu (MCU1.43)
RF_RXD: mcu (MCU1.21), communication (P11.5 U12.2 U13.2)
RF_TXD: mcu (MCU1.22), communication (P11.4 U12.3 U13.3)